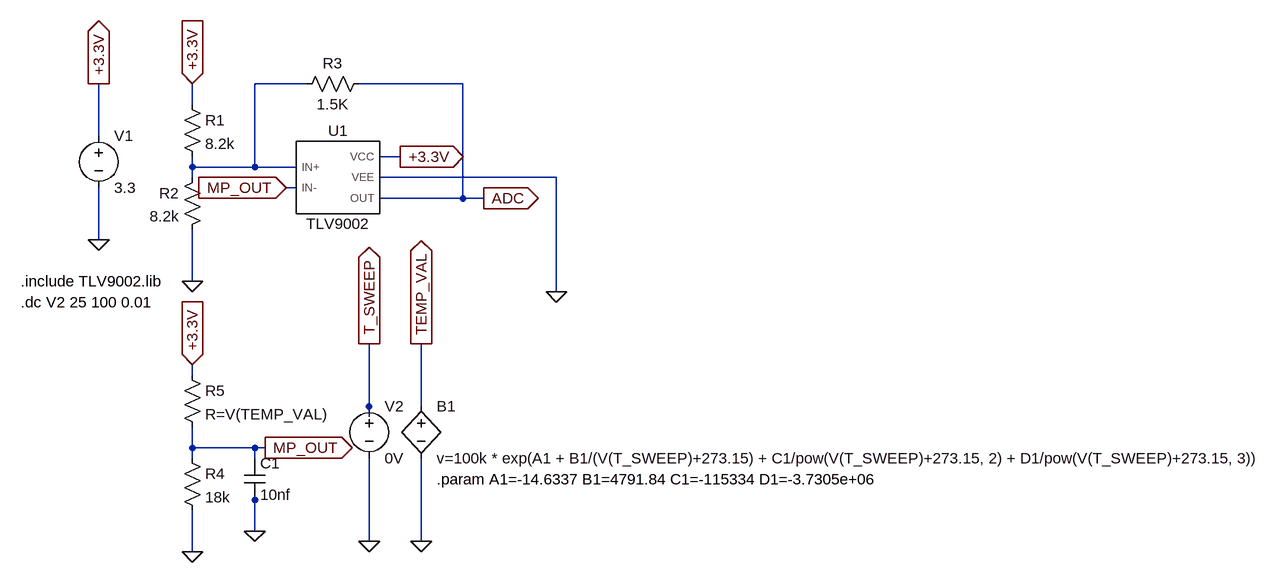
[diagram p0: schematic Thermistor Linearization.asc]
Thermistor Linearization.asc, the LTspice schematic file:
Version 4.1
SHEET 1 1976 756
WIRE 384 16 304 16
WIRE 624 16 464 16
WIRE 208 48 208 16
WIRE 64 96 64 16
WIRE 528 128 496 128
WIRE 208 144 208 128
WIRE 304 144 304 16
WIRE 304 144 208 144
WIRE 368 144 304 144
WIRE 208 160 208 144
WIRE 768 160 496 160
WIRE 368 176 352 176
WIRE 624 192 624 16
WIRE 624 192 496 192
WIRE 656 192 624 192
WIRE 64 256 64 176
WIRE 208 320 208 240
WIRE 768 336 768 160
WIRE 208 464 208 448
WIRE 480 512 480 416
WIRE 560 512 560 416
WIRE 480 528 480 512
WIRE 208 576 208 544
WIRE 304 576 208 576
WIRE 320 576 304 576
WIRE 208 592 208 576
WIRE 304 592 304 576
WIRE 304 656 304 640
WIRE 304 704 304 656
WIRE 480 720 480 592
WIRE 560 720 560 592
WIRE 208 736 208 672
FLAG 768 336 0
FLAG 656 192 ADC
IOPIN 656 192 Out
FLAG 64 256 0
FLAG 64 16 +3.3V
IOPIN 64 16 Out
FLAG 528 128 +3.3V
IOPIN 528 128 Out
FLAG 208 16 +3.3V
IOPIN 208 16 In
FLAG 208 320 0
FLAG 320 576 MP_OUT
IOPIN 320 576 Out
FLAG 208 736 0
FLAG 352 176 MP_OUT
IOPIN 352 176 In
FLAG 208 448 +3.3V
IOPIN 208 448 In
FLAG 560 720 0
FLAG 560 416 TEMP_VAL
IOPIN 560 416 Out
FLAG 480 720 0
FLAG 480 416 T_SWEEP
IOPIN 480 416 Out
FLAG 304 704 0
SYMBOL TLV9002 432 160 R0
SYMATTR InstName U1
SYMBOL voltage 64 80 R0
WINDOW 123 0 0 Left 0
WINDOW 39 0 0 Left 0
SYMATTR InstName V1
SYMATTR Value 3.3
SYMBOL res 192 32 R0
SYMATTR InstName R1
SYMATTR Value 8.2k
SYMBOL res 224 144 M0
SYMATTR InstName R2
SYMATTR Value 8.2k
SYMBOL res 480 0 R90
WINDOW 0 0 56 VBottom 2
WINDOW 3 32 56 VTop 2
SYMATTR InstName R3
SYMATTR Value 1.5K
SYMBOL res 192 576 R0
SYMATTR InstName R4
SYMATTR Value 18k
SYMBOL bv 560 496 R0
SYMATTR InstName B1
SYMATTR Value v=100k * exp(A1 + B1/(V(T_SWEEP)+273.15) + C1/pow(V(T_SWEEP)+273.15, 2) + D1/pow(V(T_SWEEP)+273.15, 3))
SYMBOL res 192 448 R0
SYMATTR InstName R5
SYMATTR Value R=V(TEMP_VAL)
SYMBOL voltage 480 496 R0
SYMATTR InstName V2
SYMATTR Value 0V
SYMBOL cap 288 592 R0
SYMATTR InstName C1
SYMATTR Value 10nf
TEXT -56 320 Left 2 !.include TLV9002.lib
TEXT -56 352 Left 2 !.dc V2 25 100 0.01
TEXT 584 624 Left 2 !.param A1=-14.6337 B1=4791.84 C1=-115334 D1=-3.7305e+06

The netlist it stands for:
* Thermistor Linearization.asc
X§U1 N001 MP_OUT +3.3V 0 ADC TLV9002  ; pins IN+ IN- VCC VEE OUT
V1 +3.3V 0 3.3
R1 +3.3V N001 8.2k
R2 N001 0 8.2k
R3 ADC N001 1.5K
R4 MP_OUT 0 18k
B1 TEMP_VAL 0 v=100k * exp(A1 + B1/(V(T_SWEEP)+273.15) + C1/pow(V(T_SWEEP)+273.15, 2) + D1/pow(V(T_SWEEP)+273.15, 3))
R5 +3.3V MP_OUT R=V(TEMP_VAL)
V2 T_SWEEP 0 0V
C1 MP_OUT 0 10nf
.include TLV9002.lib
.dc V2 25 100 0.01
.param A1=-14.6337 B1=4791.84 C1=-115334 D1=-3.7305e+06
.lib "Put your system path to" -> \tlv9002.lib
.backanno
.end